# EAGLE design dtv2usb (EAGLE 4.16)
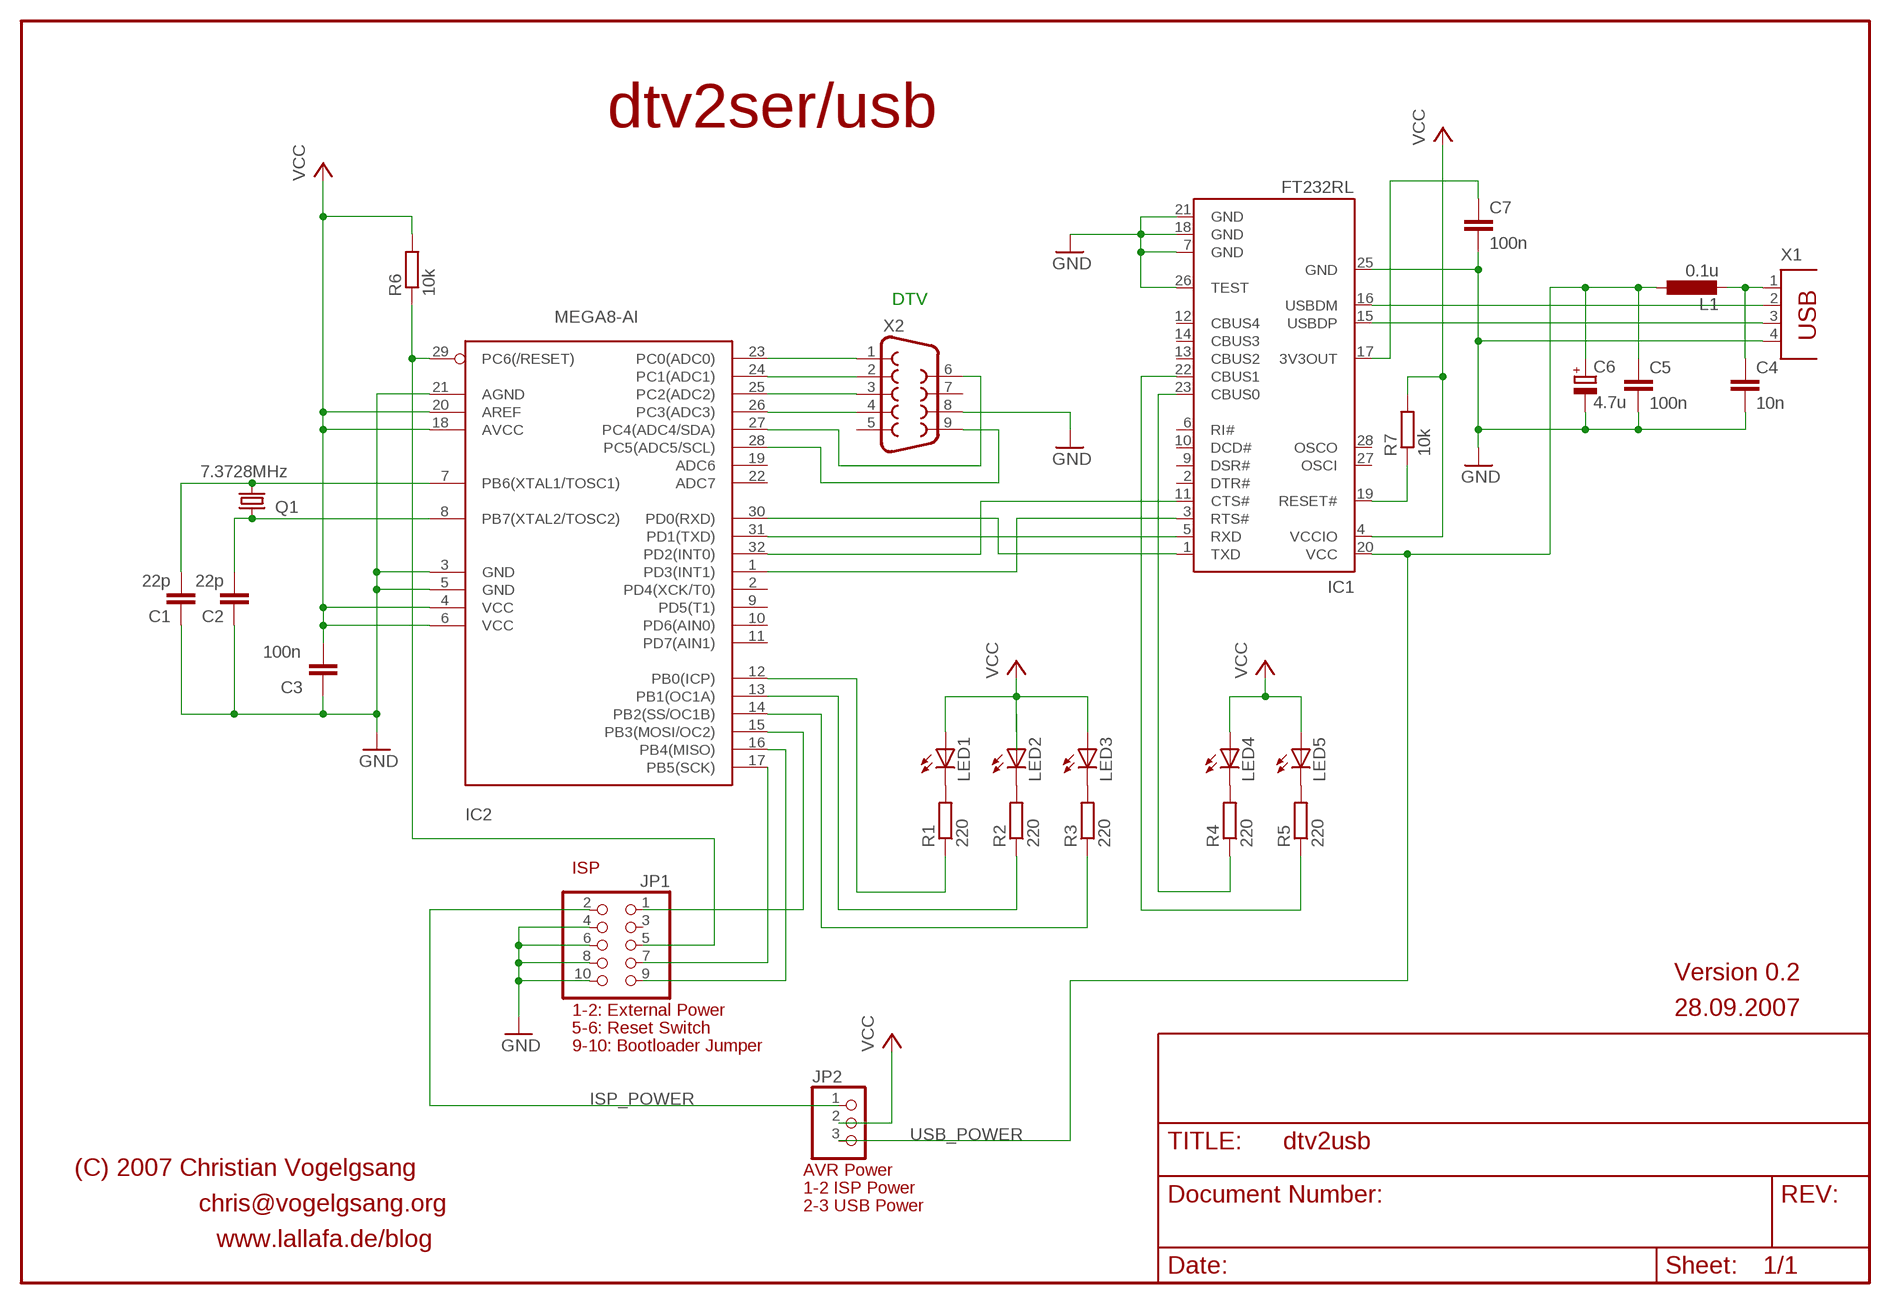
[diagram p0: schematic, sheet 1]

## Parts
C1  22p  C-EUC0805  [C0805]
C2  22p  C-EUC0805  [C0805]
C3  100n  C-EUC0805  [C0805]
C4  10n  C-EUC0805  [C0805]
C5  100n  C-EUC0805  [C0805]
C6  4.7u  CPOL-EUSMCC  [SMC_C]
C7  100n  C-EUC0805  [C0805]
IC1  FT232RL  [SSOP28]
IC2  MEGA8-AI  [TQFP32-08]
JP1  PINHD-2X5  [2X05]
JP2  PINHD-1X3  [1X03]
L1  0.1u  L-EUL0805  [L0805]
LED1  LEDCHIPLED_0805  [CHIPLED_0805]
LED2  LEDCHIPLED_0805  [CHIPLED_0805]
LED3  LEDCHIPLED_0805  [CHIPLED_0805]
LED4  LEDCHIPLED_0805  [CHIPLED_0805]
LED5  LEDCHIPLED_0805  [CHIPLED_0805]
Q1  7.3728MHz  CRYSTALHC49UP  [HC49UP]
R1  220  R-EU_R0805  [R0805]
R2  220  R-EU_R0805  [R0805]
R3  220  R-EU_R0805  [R0805]
R4  220  R-EU_R0805  [R0805]
R5  220  R-EU_R0805  [R0805]
R6  10k  R-EU_R0805  [R0805]
R7  10k  R-EU_R0805  [R0805]
X1  PN87520  [PN87520]
X2  F09D  [F09D]

## Nets
GND: C1.1 C2.1 C3.1 C4.2 C5.2 C6.- C7.2 IC1.7(GND) IC1.18(GND) IC1.21(GND) IC1.25(GND) IC1.26(TEST) IC2.3(GND) IC2.5(GND) IC2.21(AGND) JP1.4 JP1.6 JP1.8 JP1.10 X1.4 X2.8
ISP_POWER: JP1.2 JP2.1
N$1: IC1.16(USBDM) X1.2
N$2: IC1.5(RXD) IC2.31(PD1(TXD))
N$3: IC1.15(USBDP) X1.3
N$4: IC1.1(TXD) IC2.30(PD0(RXD))
N$5: C4.1 L1.2 X1.1
N$6: IC1.11(CTS#) IC2.32(PD2(INT0))
N$7: IC1.3(RTS#) IC2.1(PD3(INT1))
N$8: IC2.23(PC0(ADC0)) X2.1
N$9: IC2.24(PC1(ADC1)) X2.2
N$10: IC2.25(PC2(ADC2)) X2.3
N$11: IC2.26(PC3(ADC3)) X2.4
N$12: IC2.27(PC4(ADC4/SDA)) X2.6
N$13: IC2.28(PC5(ADC5/SCL)) X2.9
N$14: C2.2 IC2.8(PB7(XTAL2/TOSC2)) Q1.1
N$15: C1.2 IC2.7(PB6(XTAL1/TOSC1)) Q1.2
N$16: IC1.19(RESET#) R7.1
N$17: IC2.15(PB3(MOSI/OC2)) JP1.1
N$18: LED1.C R1.2
N$19: LED2.C R2.2
N$20: LED3.C R3.2
N$21: IC2.16(PB4(MISO)) JP1.9
N$22: IC2.17(PB5(SCK)) JP1.7
N$23: IC2.14(PB2(SS/OC1B)) R3.1
N$24: IC2.13(PB1(OC1A)) R2.1
N$25: IC2.12(PB0(ICP)) R1.1
N$26: C7.1 IC1.17(3V3OUT)
N$28: IC2.29(PC6(/RESET)) JP1.5 R6.1
N$30: LED4.C R4.2
N$31: LED5.C R5.2
N$33: IC1.23(CBUS0) R4.1
N$34: IC1.22(CBUS1) R5.1
USB_POWER: C5.1 C6.+ IC1.20(VCC) JP2.3 L1.1
VCC: C3.2 IC1.4(VCCIO) IC2.4(VCC) IC2.6(VCC) IC2.18(AVCC) IC2.20(AREF) JP2.2 LED1.A LED2.A LED3.A LED4.A LED5.A R6.2 R7.2
Unconnected: IC1.2(DTR#) IC1.6(RI#) IC1.9(DSR#) IC1.10(DCD#) IC1.12(CBUS4) IC1.13(CBUS2) IC1.14(CBUS3) IC1.27(OSCI) IC1.28(OSCO) IC2.2(PD4(XCK/T0)) IC2.9(PD5(T1)) IC2.10(PD6(AIN0)) IC2.11(PD7(AIN1)) IC2.19(ADC6) IC2.22(ADC7) JP1.3 X2.5 X2.7

## Notes on the sheet
- dtv2ser/usb
- DTV
- ISP
- Version 0.2
- 1-2: External Power | 28.09.2007
- 5-6: Reset Switch
- 9-10: Bootloader Jumper
- (C) 2007 Christian Vogelgsang | AVR Power
- 1-2 ISP Power
- chris@vogelgsang.org | 2-3 USB Power
- www.lallafa.de/blog

## Library data of the parts
C1-C3 = rcl:C-EU: CAPACITOR, European symbol
C4 C5 C7 = rcl-2:C-EU: CAPACITOR, European symbol
C6 = rcl-2:CPOL-EU: POLARIZED CAPACITOR, European symbol
IC1 = ftdichip:FT232R: Source: http://www.ftdichip.com/Documents/DataSheets/DS_FT232R_v104.pdf
IC2 = atmel:MEGA8: MICROCONTROLLER 8 Kbytes FLASH 1 kbytes SRAM 512 bytes EEPROM USART 6-channel 10 bit ADC 2-channel 8 bit ADC Source: avr.lbr
JP1 = pinhead:PINHD-2X5: PIN HEADER
JP2 = pinhead:PINHD-1X3: PIN HEADER
L1 = rcl-2:L-EU: INDUCTOR, European symbol
LED1-LED5 = led:LED: LED OSRAM: - CHIPLED LG R971, LG N971, LY N971, LG Q971, LY Q971, LO R971, LY R971 LH N974, LH R974 LS Q976, LO Q976, LY Q976 LO Q996 - Hyper CHIPLED LW Q18S LB Q993, LB Q99A, LB R99A - SideLED LS A670, LO A670, LY A670, LG A670, LP A670 LB A673, LV A673, LT A673, LW A673 LH A674 LY A675 LS A676, LA A676, LO A676, LY A676, LW A676 LS A679, LY A679, LG A679 - Hyper Micro SIDELED® LS Y876, LA Y876, LO Y876, LY Y876 LT Y87S - SmartLED LW L88C, LW L88S LB L89C, LB L89S, LG L890 LS L89K, LO L89K, LY L89K LS L896, LA L896, LO L896, LY L896 - TOPLED LS T670, LO T670, LY T670, LG T670, LP T670 LSG T670, LSP T670, LSY T670, LOP T670, LYG T670 LG T671, LOG T671, LSG T671 LB T673, LV T673, LT T673, LW T673 LH T674 LS T676, LA T676, LO T676, LY T676, LB T676, LH T676, LSB T676, LW T676 LB T67C, LV T67C, LT T67C, LS T67K, LO T67K, LY T67K, LW E67C LS E67B, LA E67B, LO E67B, LY E67B, LB E67C, LV E67C, LT E67C LW T67C LS T679, LY T679, LG T679 LS T770, LO T770, LY T770, LG T770, LP T770 LB T773, LV T773, LT T773, LW T773 LH T774 LS E675, LA E675, LY E675, LS T675 LS T776, LA T776, LO T776, LY T776, LB T776 LHGB T686 LT T68C, LB T68C - Hyper Mini TOPLED® LB M676 - Mini TOPLED Santana® LG M470 LS M47K, LO M47K, LY M47K Source: http://www.osram.convergy.de - LUMILED® LXK2-PW12-R00, LXK2-PW12-S00, LXK2-PW14-U00, LXK2-PW14-V00 LXK2-PM12-R00, LXK2-PM12-S00, LXK2-PM14-U00 LXK2-PE12-Q00, LXK2-PE12-R00, LXK2-PE12-S00, LXK2-PE14-T00, LXK2-PE14-U00 LXK2-PB12-K00, LXK2-PB12-L00, LXK2-PB12-M00, LXK2-PB14-N00, LXK2-PB14-P00, LXK2-PB14-Q00 LXK2-PR12-L00, LXK2-PR12-M00, LXK2-PR14-Q00, LXK2-PR14-R00 LXK2-PD12-Q00, LXK2-PD12-R00, LXK2-PD12-S00 LXK2-PH12-R00, LXK2-PH12-S00 LXK2-PL12-P00, LXK2-PL12-Q00, LXK2-PL12-R00 Source: www.luxeon.com
Q1 = crystal:CRYSTAL: CRYSTAL
R1-R7 = rcl:R-EU_: RESISTOR, European symbol
X1 = con-berg:PN87520: BERG USB connector
X2 = con-subd:F09: SUB-D

## Board
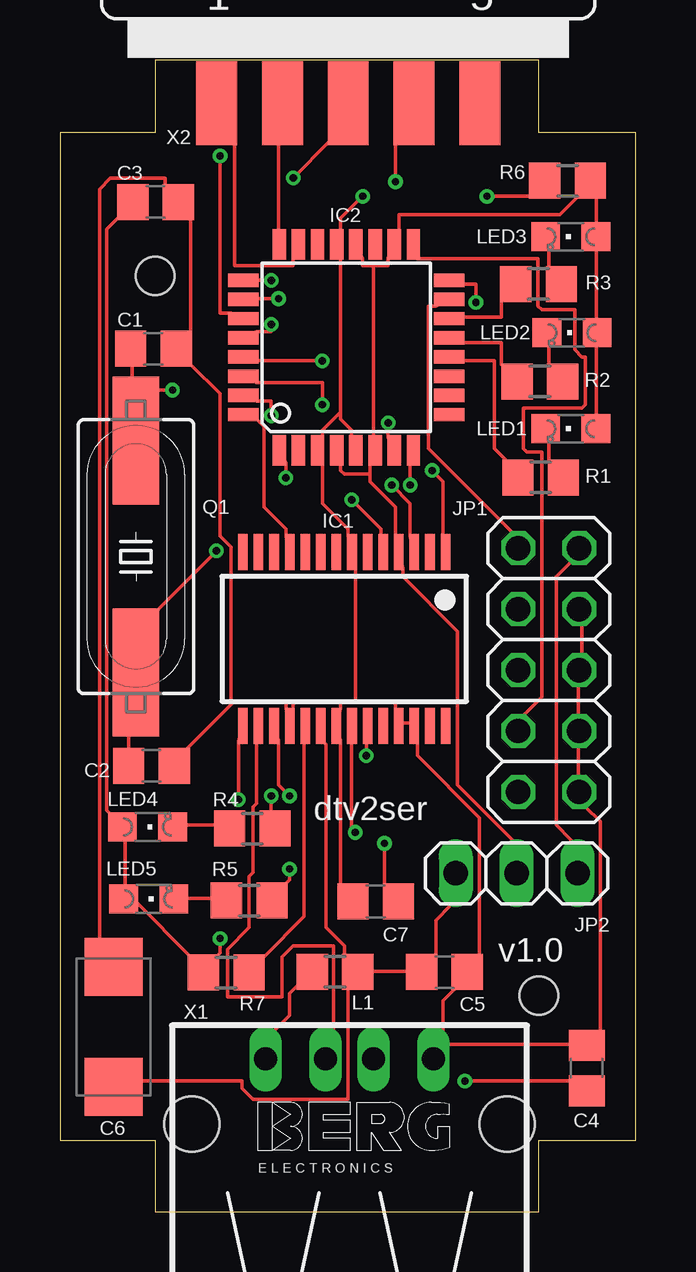
[diagram p1: board, top side]
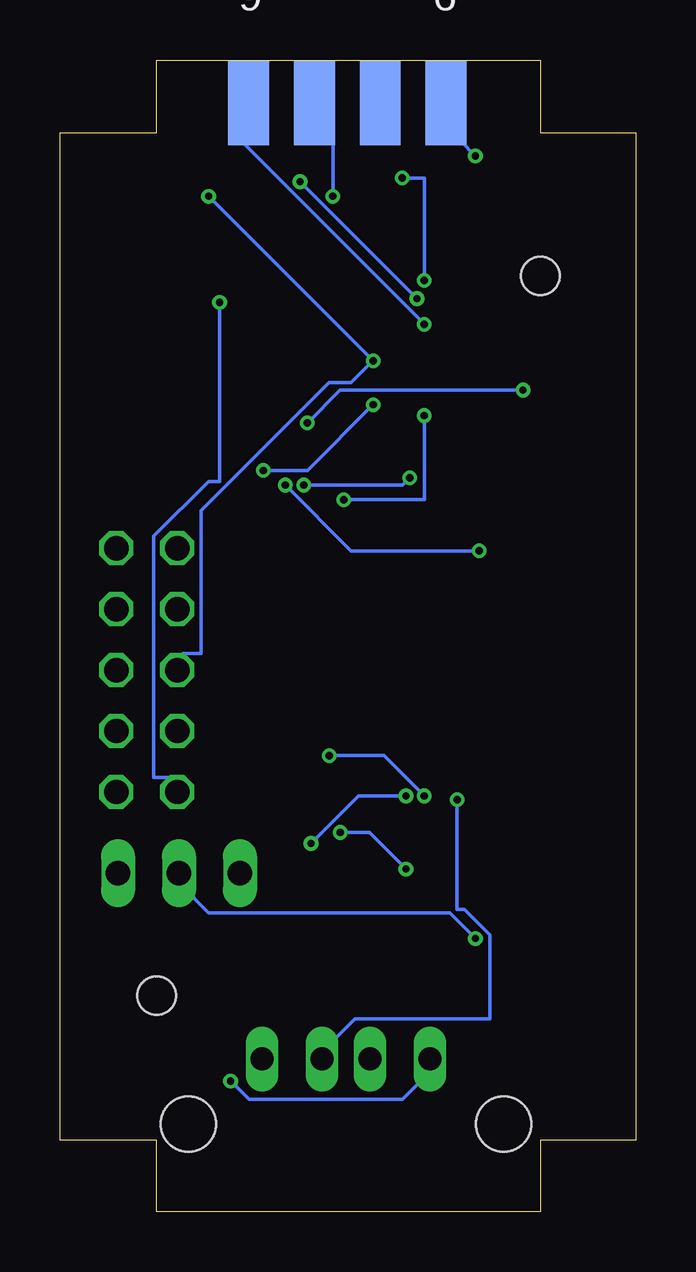
[diagram p2: board, bottom side, seen from below]

Size 24 x 48 mm. Coordinates in mm from the lower left corner, seen from the top.
Outline: 0,2.97 3.97,2.97 3.97,0 19.97,0 19.97,2.97 24,2.97 24,44.97 19.97,44.97 19.97,48 3.97,48 3.97,44.97 0,44.97 0,2.97
Copper layers (1*16): Top 0.035mm / dielectric 1.5mm / Bottom 0.035mm
Design rules "PCB-POOL": minimum track width 6mil, minimum drill 12mil, track to track 6mil, track to pad 6mil, pad to pad 6mil, via to via 6mil, smd to smd 6mil, copper to edge 20mil, drill to drill 8mil, minimum pad ring 8mil, minimum via ring 6mil, stop-mask expansion 3mil, vias tented up to drill 0mil, thermal gap 8mil
Holes 1.6 mm at 3.97,39 19.97,9

### Footprints (pad centres in the part's own frame; a part is rotated, then mirrored left to right if it is on the bottom)
C0805 = smd 1.3 x 1.5: 1 -0.95,0; 2 0.95,0
SMC_C = smd 2.4 x 2.4: + -2.5,0; - 2.5,0
SSOP28 = smd 0.4 x 1.5: 1 -4.225,-3.625; 2 -3.575,-3.625; 3 -2.925,-3.625; 4 -2.275,-3.625; 5 -1.625,-3.625; 6 -0.975,-3.625; 7 -0.325,-3.625; 8 0.325,-3.625; 9 0.975,-3.625; 10 1.625,-3.625; 11 2.275,-3.625; 12 2.925,-3.625; 13 3.575,-3.625; 14 4.225,-3.625; 15 4.225,3.625; 16 3.575,3.625; 17 2.925,3.625; 18 2.275,3.625; 19 1.625,3.625; 20 0.975,3.625; 21 0.325,3.625; 22 -0.325,3.625; 23 -0.975,3.625; 24 -1.625,3.625; 25 -2.275,3.625; 26 -2.925,3.625; 27 -3.575,3.625; 28 -4.225,3.625
TQFP32-08 = smd 1.27 x 0.559: 1 -4.293,2.8; 2 -4.293,2; 3 -4.293,1.2; 4 -4.293,0.4; 5 -4.293,-0.4; 6 -4.293,-1.2; 7 -4.293,-2; 8 -4.293,-2.8; 17 4.293,-2.8; 18 4.293,-2; 19 4.293,-1.2; 20 4.293,-0.4; 21 4.293,0.4; 22 4.293,1.2; 23 4.293,2; 24 4.293,2.8 | smd 0.559 x 1.27: 9 -2.8,-4.293; 10 -2,-4.293; 11 -1.2,-4.293; 12 -0.4,-4.293; 13 0.4,-4.293; 14 1.2,-4.293; 15 2,-4.293; 16 2.8,-4.293; 25 2.8,4.293; 26 2,4.293; 27 1.2,4.293; 28 0.4,4.293; 29 -0.4,4.293; 30 -1.2,4.293; 31 -2,4.293; 32 -2.8,4.293
2X05 = drill 1.016 octagon: 1 -5.08,-1.27; 2 -5.08,1.27; 3 -2.54,-1.27; 4 -2.54,1.27; 5 0,-1.27; 6 0,1.27; 7 2.54,-1.27; 8 2.54,1.27; 9 5.08,-1.27; 10 5.08,1.27
1X03 = drill 1.016 long: 1 -2.54,0; 2 0,0; 3 2.54,0
L0805 = smd 1.3 x 1.5: 1 -0.95,0; 2 0.95,0
CHIPLED_0805 = smd 1.2 x 1.2: A 0,-1.05; C 0,1.05
HC49UP = smd 5.334 x 1.93: 1 -4.826,0; 2 4.826,0
R0805 = smd 1.3 x 1.5: 1 -0.95,0; 2 0.95,0
PN87520 = drill 0.95 long: 1 -3.5,2.71; 2 -1,2.71; 3 1,2.71; 4 3.5,2.71 | hole 2.3: -6.57,0; 6.57,0
F09D = smd 1.7 x 3.5: 1 -5.486,-6.045; 2 -2.743,-6.045; 3 0,-6.045; 4 2.743,-6.045; 5 5.486,-6.045 | smd 1.7 x 3.5 bottom: 6 -4.115,-6.045; 7 -1.372,-6.045; 8 1.372,-6.045; 9 4.115,-6.045

### Placement (x,y rotation side)
C1  3.9,35.96 180 top
C2  3.82,18.58 180 top
C3  3.99,42.08 180 top
C4  21.96,5.98 90 top
C5  16.03,9.98 0 top
C6  2.24,7.7 90 top
C7  13.17,12.93 180 top
IC1  11.85,23.87 180 top
IC2  11.94,36.02 90 top
JP1  20.38,22.57 270 top
JP2  19.04,14.1 180 top
L1  11.47,10 180 top
LED1  21.3,32.63 90 top
LED2  21.35,36.63 90 top
LED3  21.3,40.63 90 top
LED4  3.65,16.03 270 top
LED5  3.7,13.03 270 top
Q1  3.17,27.3 90 top
R1  20.04,30.6 0 top
R2  20.01,34.6 0 top
R3  19.95,38.66 0 top
R4  8.02,15.96 180 top
R5  7.89,12.96 180 top
R6  21.16,42.96 0 top
R7  6.93,9.96 180 top
X1  12.07,3.65 0 top
X2  12.02,52.25 0 top

### Tracks (layer width: path | path; a pad name or v marks a point on that pad's centre or on a via)
GND  (via drill 0.3)
  Top 0.152: C6.- 1.65,11.38 1.65,42.62 2.1,43.08 4.39,43.08 4.39,42.78 C3.1 5.46,41.41 5.46,36.68 C1.1 5.46,35.31 6.68,34.09 6.68,28.15 7.13,27.69 7.13,21.14 | JP1.4 21.76,24.49 21.76,23.27 JP1.6 21.61,21.9 21.61,20.68 JP1.8 21.61,19.46 21.61,18.09 JP1.10 21.92,16.87 22.52,16.26 22.52,7.57 C4.2 21.31,6.96 16.12,6.96 X1.4 15.97,7.57 15.97,8.79 16.43,9.25 C5.2 17.5,10.62 17.5,16.41 14.91,19 14.91,19.61 IC1.26 14.6,20.37 14.3,20.37 IC1.25 13.99,20.98 13.99,21.14 13.84,21.29 12.31,21.29 | 7.13,21.14 7.29,21.29 9.42,21.29 9.42,20.98 IC1.18 9.72,20.98 9.72,21.14 9.88,21.29 11.71,21.29 | 7.13,21.14 5.3,19.31 C2.1 | C7.2 11.71,13.67 11.71,19.61 IC1.21 11.71,20.98 11.71,21.29 | 11.71,21.29 12.31,21.29 | 11.71,33.33 11.71,33.02 12.16,32.57 12.16,32.26 IC2.5 | 11.71,33.33 11.71,39.73 IC2.21 11.71,40.8 11.71,41.41 v12.62,42.32 | 11.71,33.33 10.94,32.57 10.94,32.26 IC2.3 10.94,31.19 10.94,29.52 12.01,28.45 12.01,28.15 IC1.7 12.31,26.77 12.31,21.29
  Bottom 0.152: v12.62,42.32 12.62,44.6 X2.8
ISP_POWER
  Top 0.152: JP2.1 21.31,15.5 20.7,16.11 20.7,26.47 21.31,27.08 JP1.2
N$1
  Top 0.152: IC1.16 8.2,19.61 8.2,17.02 8.05,16.87 8.05,14.12 7.89,13.97 7.89,11.84 6.98,10.93 6.98,8.94 9.27,8.94 9.27,10.62 9.72,11.08 11.4,11.08 11.4,7.57 X1.2
N$2  (via drill 0.3)
  Top 0.152: v8.81,33.17 8.81,33.78 8.2,33.78 IC2.31 | v12.16,29.67 13.38,28.45 13.38,28.15 IC1.5
  Bottom 0.152: v8.81,33.17 8.81,29.67 v12.16,29.67
N$3  (via drill 0.3)
  Top 0.152: v7.44,17.17 7.44,19.61 IC1.15
  Bottom 0.152: v7.44,17.17 7.44,12.6 7.13,12.6 6.07,11.53 6.07,8.03 11.71,8.03 12.47,7.27 X1.3
N$4  (via drill 0.3)
  Top 0.152: v10.94,33.63 10.94,34.55 8.2,34.55 IC2.30 | v15.52,30.89 15.97,30.43 15.97,28.15 IC1.1
  Bottom 0.152: v10.94,33.63 13.69,30.89 v15.52,30.89
N$5  (via drill 0.3)
  Top 0.152: L1.2 9.88,9.4 9.57,9.1 9.57,8.18 8.96,7.57 X1.1 | v16.89,5.44 21.31,5.44 C4.1
  Bottom 0.152: v16.89,5.44 16.12,4.68 9.72,4.68 9.11,5.29 X1.1
N$6
  Top 0.152: IC2.32 8.2,33.02 8.5,32.72 8.5,29.36 9.42,28.45 9.42,28.15 IC1.11
N$7  (via drill 0.3)
  Top 0.152: v9.42,30.58 9.42,31.19 IC2.1 | v13.84,30.28 14.6,29.52 14.6,28.15 IC1.3
  Bottom 0.152: v9.42,30.58 9.72,30.28 v13.84,30.28
N$8
  Top 0.152: IC2.23 9.72,39.73 9.72,39.42 7.29,39.42 7.29,44.6 X2.1
N$9
  Top 0.152: IC2.24 9.11,40.8 9.11,44.6 X2.2
N$10  (via drill 0.3)
  Top 0.152: v8.81,38.81 8.2,38.81 IC2.25 | v9.72,43.08 11.25,44.6 X2.3
  Bottom 0.152: v8.81,38.81 8.81,43.08 v9.72,43.08
N$11  (via drill 0.3)
  Top 0.152: v9.11,38.05 8.2,38.05 IC2.26 | v13.99,42.93 13.99,44.6 X2.4
  Bottom 0.152: v9.11,38.05 v13.99,42.93
N$12  (via drill 0.3)
  Top 0.152: v6.68,44 6.68,37.44 7.13,37.44 IC2.27
  Bottom 0.152: v6.68,44 7.29,44.6 X2.6
N$13  (via drill 0.3)
  Top 0.152: v8.81,36.98 8.81,36.68 8.2,36.68 IC2.28
  Bottom 0.152: v8.81,36.98 16.43,44.6 X2.9
N$14  (via drill 0.3)
  Top 0.152: v14.6,30.28 14.6,31.19 IC2.8 | v6.52,27.54 4.08,25.1 Q1.1 2.87,19.92 2.87,19.31 C2.2
  Bottom 0.152: v14.6,30.28 11.86,27.54 v6.52,27.54
N$15  (via drill 0.3)
  Top 0.152: v13.69,32.87 13.69,32.26 IC2.7 | v4.69,34.24 4.08,34.24 Q1.2 3.02,34.7 3.02,35.31 C1.2
  Bottom 0.152: v13.69,32.87 12.31,34.24 v4.69,34.24
N$16
  Top 0.152: R7.1 8.5,10.62 10.18,12.3 10.18,19.61 IC1.19
N$17
  Top 0.152: IC2.15 15.67,37.75 15.36,37.75 15.36,31.8 18.87,28.3 JP1.1
N$18
  Top 0.152: LED1.C 20.39,32.11 20.39,31.35 R1.2
N$19
  Top 0.152: LED2.C 20.39,36.07 20.39,35.31 R2.2
N$20
  Top 0.152: LED3.C 20.39,40.03 20.39,39.27 R3.2
N$21  (via drill 0.3)
  Top 0.152: v17.34,37.9 17.34,38.66 16.73,38.66 IC2.16
  Bottom 0.152: v17.34,37.9 17.34,30.43 17.8,30.43 20.09,28.15 20.09,18.09 19.48,18.09 JP1.9
N$22
  Top 0.152: IC2.17 14.91,39.73 19.93,39.73 19.93,37.75 20.09,37.59 21.46,37.59 21.46,35.92 21.76,35.61 21.92,35.61 21.92,33.63 21.76,33.48 19.32,33.48 19.32,31.8 19.48,31.65 20.09,31.65 20.09,21.44 19.32,20.68 JP1.7
N$23
  Top 0.152: IC2.14 16.73,37.29 18.41,37.29 18.41,38.05 R3.1
N$24
  Top 0.152: IC2.13 16.73,36.22 18.41,36.22 18.41,35.31 R2.1
N$25
  Top 0.152: IC2.12 16.73,35.46 18.11,35.46 18.11,31.8 18.56,31.35 R1.1
N$26  (via drill 0.3)
  Top 0.152: v13.53,15.34 13.53,13.67 C7.1 | v9.57,17.33 9.11,17.78 9.11,19.61 IC1.17
  Bottom 0.152: v13.53,15.34 11.55,17.33 v9.57,17.33
N$28  (via drill 0.3)
  Top 0.152: v10.94,35.46 8.2,35.46 IC2.29 | v17.8,42.32 19.63,42.32 R6.1
  Bottom 0.152: JP1.5 18.87,23.27 18.11,23.27 18.11,29.21 12.77,34.55 11.86,34.55 v10.94,35.46 v17.8,42.32
N$30
  Top 0.152: LED4.C 5.15,16.11 6.52,16.11 R4.2
N$31
  Top 0.152: LED5.C 5.3,13.06 6.37,13.06 R5.2
N$33  (via drill 0.3)
  Top 0.152: v8.81,17.33 8.81,16.56 R4.1 | v12.77,19 12.77,19.61 IC1.23
  Bottom 0.152: v8.81,17.33 10.49,19 v12.77,19
N$34  (via drill 0.3)
  Top 0.152: v9.57,14.28 9.57,13.82 9.42,13.67 R5.1 | v12.31,15.8 12.16,15.95 12.16,19.61 IC1.22
  Bottom 0.152: v9.57,14.28 11.1,15.8 v12.31,15.8
USB_POWER
  Top 0.152: L1.1 12.92,10.01 14.45,10.01 C5.1 15.67,10.62 15.67,12.14 16.28,12.75 JP2.3 | IC1.20 10.94,19.61 11.1,19.46 11.1,11.84 11.86,11.08 11.86,10.62 L1.1 | C6.+ 3.32,5.44 7.59,5.44 7.59,5.13 8.05,4.68 12.01,4.68 12.01,9.4 L1.1
VCC  (via drill 0.3)
  Top 0.152: C3.2 2.41,41.41 1.95,40.95 1.95,16.72 2.1,16.56 LED4.A 2.71,15.5 2.71,13.52 LED5.A 3.17,12.91 5.46,10.62 R7.2 6.52,10.62 6.68,10.77 v6.68,11.38 | LED1.A 22.37,33.17 22.37,36.07 LED2.A 22.37,37.14 22.37,40.03 LED3.A 22.37,41.1 22.37,42.32 R6.2 21.61,42.32 20.85,41.56 14.14,41.56 14.14,40.8 IC2.18 13.69,39.73 13.69,39.42 13.08,39.42 | 13.08,39.42 12.62,39.42 12.62,39.73 IC2.20 | 12.92,30.74 11.86,30.74 11.71,30.89 11.71,31.19 IC2.4 | 12.92,30.74 12.92,31.19 IC2.6 13.08,32.26 13.08,39.42 | 12.92,30.74 12.92,30.43 13.99,29.36 13.99,28.15 IC1.4 14.3,26.77 14.3,26.47 16.58,24.18 16.58,17.78 18.87,15.5 JP2.2
  Bottom 0.152: v6.68,11.38 7.74,12.45 17.8,12.45 18.41,13.06 JP2.2

### Text on the board
tNames: dtv2ser | v1.0